# EAGLE design monster_dac (EAGLE 6.4)

## Sheet 1 of 3: DAC
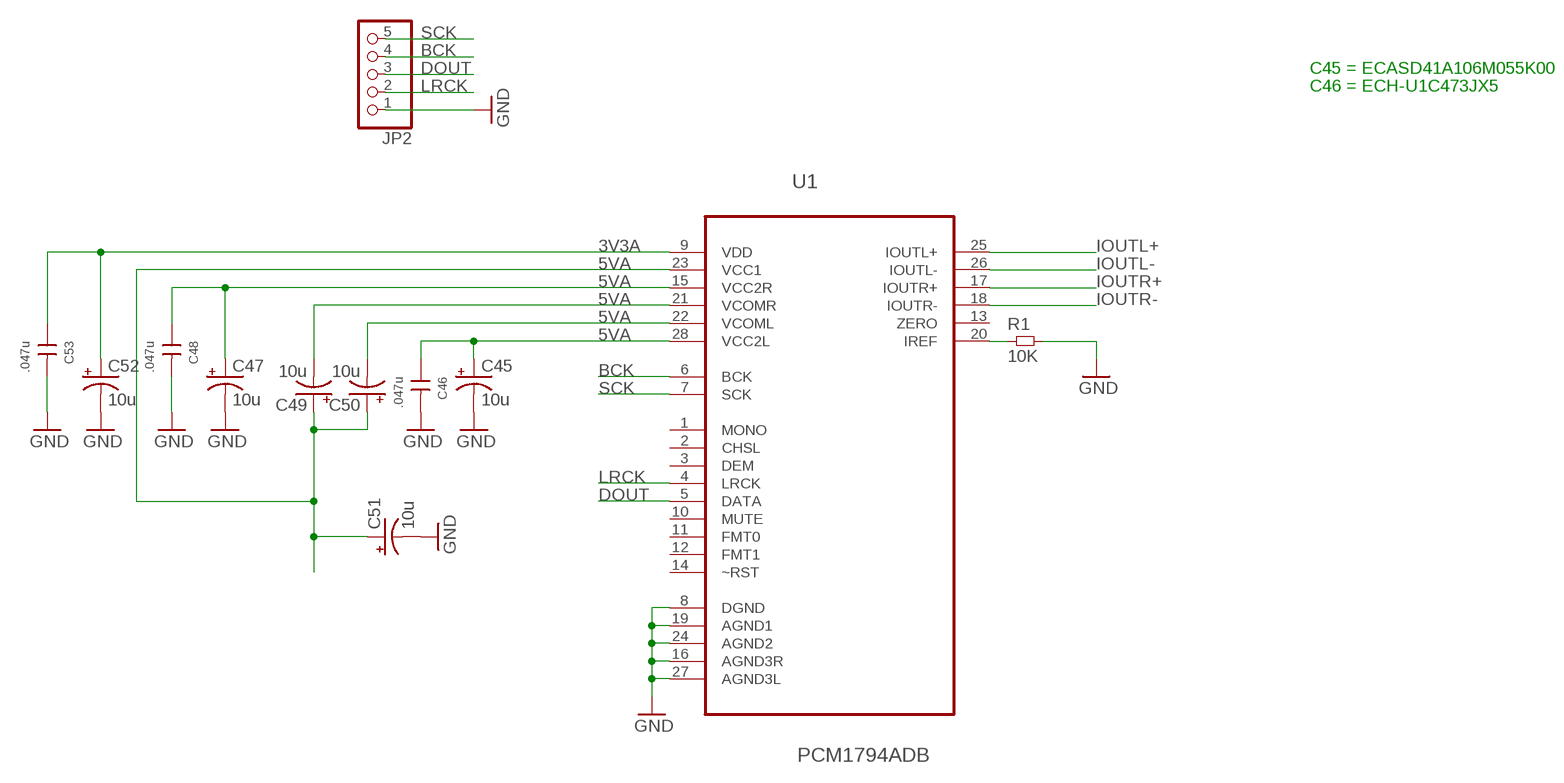
[diagram p0: schematic, sheet 1]

### Parts
C45  10u  CPOL-USE2-5  [E2-5]
C46  .047u  47NF63VMKS2  [2,5X6,5RM5,0]
C47  10u  CPOL-USE2-5  [E2-5]
C48  .047u  47NF63VMKS2  [2,5X6,5RM5,0]
C49  10u  CPOL-USE2-5  [E2-5]
C50  10u  CPOL-USE2-5  [E2-5]
C51  10u  CPOL-USE2-5  [E2-5]
C52  10u  CPOL-USE2-5  [E2-5]
C53  .047u  47NF63VMKS2  [2,5X6,5RM5,0]
JP2  PINHD-1X5  [1X05]
R1  10K  RES0603L3  [0603L3]
U1  PCM1794ADB  [SOP65P780X200-28N]

### Nets
3V3A: C52.+ C53.1 U1.9(VDD)
5VA: C45.+ C46.1 C47.+ C48.1 C49.+ C49.- C50.+ C50.- C51.+ U1.15(VCC2R) U1.21(VCOMR) U1.22(VCOML) U1.23(VCC1) U1.28(VCC2L)
BCK: JP2.4 U1.6(BCK)
DOUT: JP2.3 U1.5(DATA)
GND: C45.- C46.2 C47.- C48.2 C51.- C52.- C53.2 JP2.1 R1.P$2 U1.8(DGND) U1.16(AGND3R) U1.19(AGND1) U1.24(AGND2) U1.27(AGND3L) ; also sheet 2,3
IOUTL+: U1.25(IOUTL+) ; also sheet 2
IOUTL-: U1.26(IOUTL-) ; also sheet 2
IOUTR+: U1.17(IOUTR+) ; also sheet 2
IOUTR-: U1.18(IOUTR-) ; also sheet 2
LRCK: JP2.2 U1.4(LRCK)
N$2: R1.P$1 U1.20(IREF)
SCK: JP2.5 U1.7(SCK)
Unconnected: U1.1(MONO) U1.2(CHSL) U1.3(DEM) U1.10(MUTE) U1.11(FMT0) U1.12(FMT1) U1.13(ZERO) U1.14(~RST)

### Notes on the sheet
- C45 = ECASD41A106M055K00
- C46 = ECH-U1C473JX5

## Sheet 2 of 3: I/V Converter
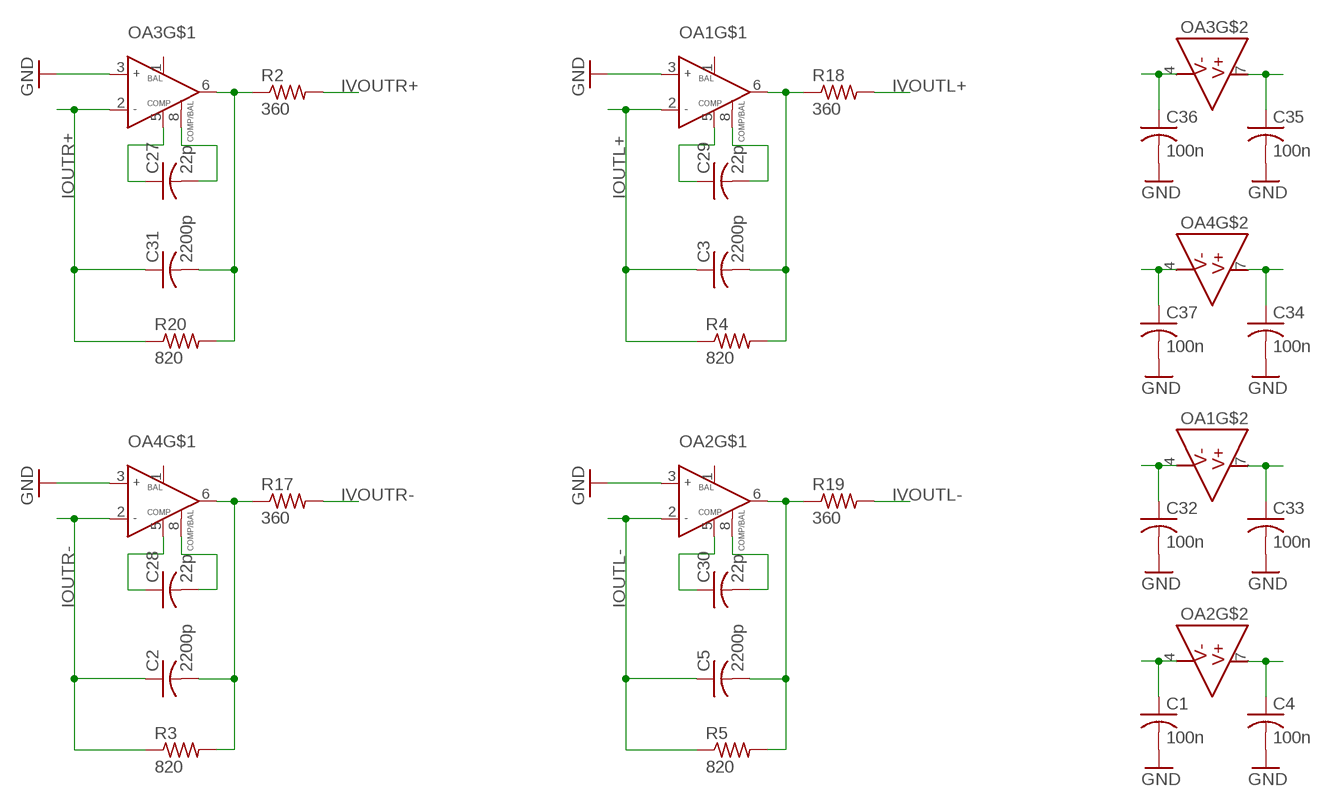
[diagram p1: schematic, sheet 2]

### Parts
C1  100n  C-USC0603  [C0603]
C2  2200p  C-USC0603  [C0603]
C3  2200p  C-USC0603  [C0603]
C4  100n  C-USC0603  [C0603]
C5  2200p  C-USC0603  [C0603]
C27  22p  C-USC0603  [C0603]
C28  22p  C-USC0603  [C0603]
C29  22p  C-USC0603  [C0603]
C30  22p  C-USC0603  [C0603]
C31  2200p  C-USC0603  [C0603]
C32  100n  C-USC0603  [C0603]
C33  100n  C-USC0603  [C0603]
C34  100n  C-USC0603  [C0603]
C35  100n  C-USC0603  [C0603]
C36  100n  C-USC0603  [C0603]
C37  100n  C-USC0603  [C0603]
OA1  NE5534ADSOIC8  [SOIC-8]
OA2  NE5534ADSOIC8  [SOIC-8]
OA3  NE5534ADSOIC8  [SOIC-8]
OA4  NE5534ADSOIC8  [SOIC-8]
R2  360  R-US_R0603  [R0603]
R3  820  R-US_R0603  [R0603]
R4  820  R-US_R0603  [R0603]
R5  820  R-US_R0603  [R0603]
R17  360  R-US_R0603  [R0603]
R18  360  R-US_R0603  [R0603]
R19  360  R-US_R0603  [R0603]
R20  820  R-US_R0603  [R0603]

### Nets
GND: C1.2 C4.2 C32.2 C33.2 C34.2 C35.2 C36.2 C37.2 OA1.3(IN+) OA2.3(IN+) OA3.3(IN+) OA4.3(IN+) ; also sheet 1,3
IOUTL+: C3.1 OA1.2(IN-) R4.1 ; also sheet 1
IOUTL-: C5.1 OA2.2(IN-) R5.1 ; also sheet 1
IOUTR+: C31.1 OA3.2(IN-) R20.1 ; also sheet 1
IOUTR-: C2.1 OA4.2(IN-) R3.1 ; also sheet 1
IVOUTL+: R18.2 ; also sheet 3
IVOUTL-: R19.2 ; also sheet 3
IVOUTR+: R2.2 ; also sheet 3
IVOUTR-: R17.2 ; also sheet 3
N$3: C4.1 OA2.7(V+)
N$5: C1.1 OA2.4(V-)
N$7: C33.1 OA1.7(V+)
N$10: C32.1 OA1.4(V-)
N$17: C27.1 OA3.5(COMP)
N$19: C27.2 OA3.8(COMP/BAL)
N$21: C28.1 OA4.5(COMP)
N$22: C28.2 OA4.8(COMP/BAL)
N$27: C29.1 OA1.5(COMP)
N$28: C29.2 OA1.8(COMP/BAL)
N$29: C30.1 OA2.5(COMP)
N$31: C30.2 OA2.8(COMP/BAL)
N$32: C31.2 OA3.6(OUT) R2.1 R20.2
N$35: C2.2 OA4.6(OUT) R3.2 R17.1
N$36: C3.2 OA1.6(OUT) R4.2 R18.1
N$37: C5.2 OA2.6(OUT) R5.2 R19.1
N$42: C37.1 OA4.4(V-)
N$43: C36.1 OA3.4(V-)
N$44: C35.1 OA3.7(V+)
N$45: C34.1 OA4.7(V+)
Unconnected: OA1.1(BAL) OA2.1(BAL) OA3.1(BAL) OA4.1(BAL)

## Sheet 3 of 3: Out Stage
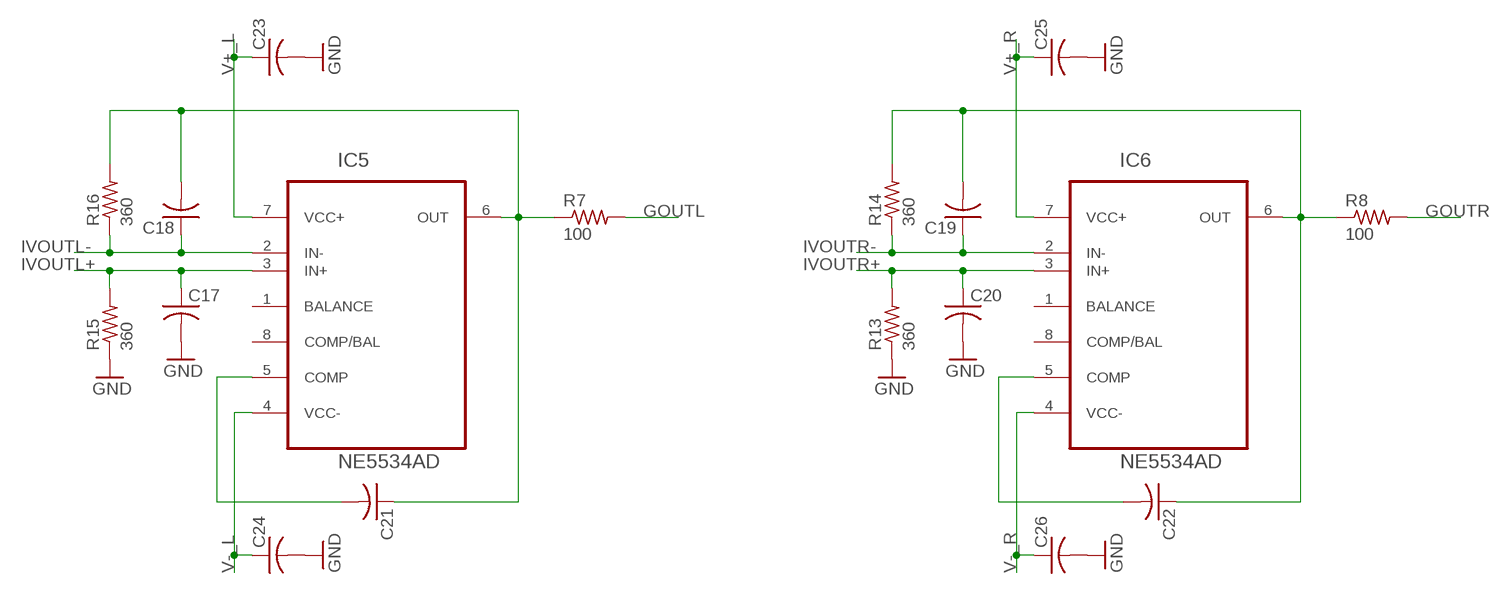
[diagram p2: schematic, sheet 3]

### Parts
C17  C-USC0603  [C0603]
C18  C-USC0603  [C0603]
C19  C-USC0603  [C0603]
C20  C-USC0603  [C0603]
C21  C-USC0603  [C0603]
C22  C-USC0603  [C0603]
C23  C-USC0603  [C0603]
C24  C-USC0603  [C0603]
C25  C-USC0603  [C0603]
C26  C-USC0603  [C0603]
IC5  NE5534AD  [SOIC127P600X175-8N]
IC6  NE5534AD  [SOIC127P600X175-8N]
R7  100  R-US_R0603  [R0603]
R8  100  R-US_R0603  [R0603]
R13  360  R-US_R0603  [R0603]
R14  360  R-US_R0603  [R0603]
R15  360  R-US_R0603  [R0603]
R16  360  R-US_R0603  [R0603]

### Nets
GND: C17.2 C20.2 C23.2 C24.2 C25.2 C26.2 R13.1 R15.1 ; also sheet 1,2
GOUTL: R7.2
GOUTR: R8.2
IVOUTL+: C17.1 IC5.3(IN+) R15.2 ; also sheet 2
IVOUTL-: C18.1 IC5.2(IN-) R16.1 ; also sheet 2
IVOUTR+: C20.1 IC6.3(IN+) R13.2 ; also sheet 2
IVOUTR-: C19.1 IC6.2(IN-) R14.1 ; also sheet 2
N$1: C18.2 C21.1 IC5.6(OUT) R7.1 R16.2
N$13: C19.2 C22.1 IC6.6(OUT) R8.1 R14.2
N$20: C21.2 IC5.5(COMP)
N$25: C22.2 IC6.5(COMP)
V+_L: C23.1 IC5.7(VCC+)
V+_R: C25.1 IC6.7(VCC+)
V-_L: C24.1 IC5.4(VCC-)
V-_R: C26.1 IC6.4(VCC-)
Unconnected: IC5.1(BALANCE) IC5.8(COMP/BAL) IC6.1(BALANCE) IC6.8(COMP/BAL)

## Library data of the parts
C1-C5 C17-C37 = rcl:C-US: CAPACITOR, American symbol
C45 C47 C49-C52 = rcl:CPOL-US: POLARIZED CAPACITOR, American symbol
C46 C48 C53 = wima_c:47NF63V
IC5 IC6 = Texas Instruments_By_element14_Batch_1:NE5534AD: LOW-NOISE OPERATIONAL AMPLIFIERS; MPN: NE5534AD; OC_FARNELL: 9589864; OC_NEWARK: 08F2508; PACKAGE: SOIC-8; SUPPLIER: Texas Instruments
JP2 = pinhead:PINHD-1X5: PIN HEADER
OA1-OA4 = common:NE5534: Low-noise, high-SP audio Op Amp.; BIAS_CURRENT: 500nA; CMRR: 100dB; GAIN_BANDWIDTH_PRODUCT: 10MHz; IN-VOL_NOISE_DENSITY: 3.5nV; OFFSET_VOL: 500uV; OUTPUT_CURRENT: 38mA; SLEW_RATE: 13V/uS; SUPPLY_CURRENT: 4mA; SUPPLY_VOL_MAX: 30V; SUPPLY_VOL_MIN: 10V
R1 = common:RES
R2-R5 R7 R8 R13-R20 = rcl:R-US_: RESISTOR, American symbol
U1 = Texas Instruments_By_element14_Batch_1:PCM1794ADB: 24-Bit 192khz Sampling advanced segment Audio stereo digital-to-analog converter; MPN: PCM1794ADB; OC_FARNELL: 1755014; OC_NEWARK: 54K0199; PACKAGE: SSOP-28; SUPPLIER: Texas Instruments

## Board
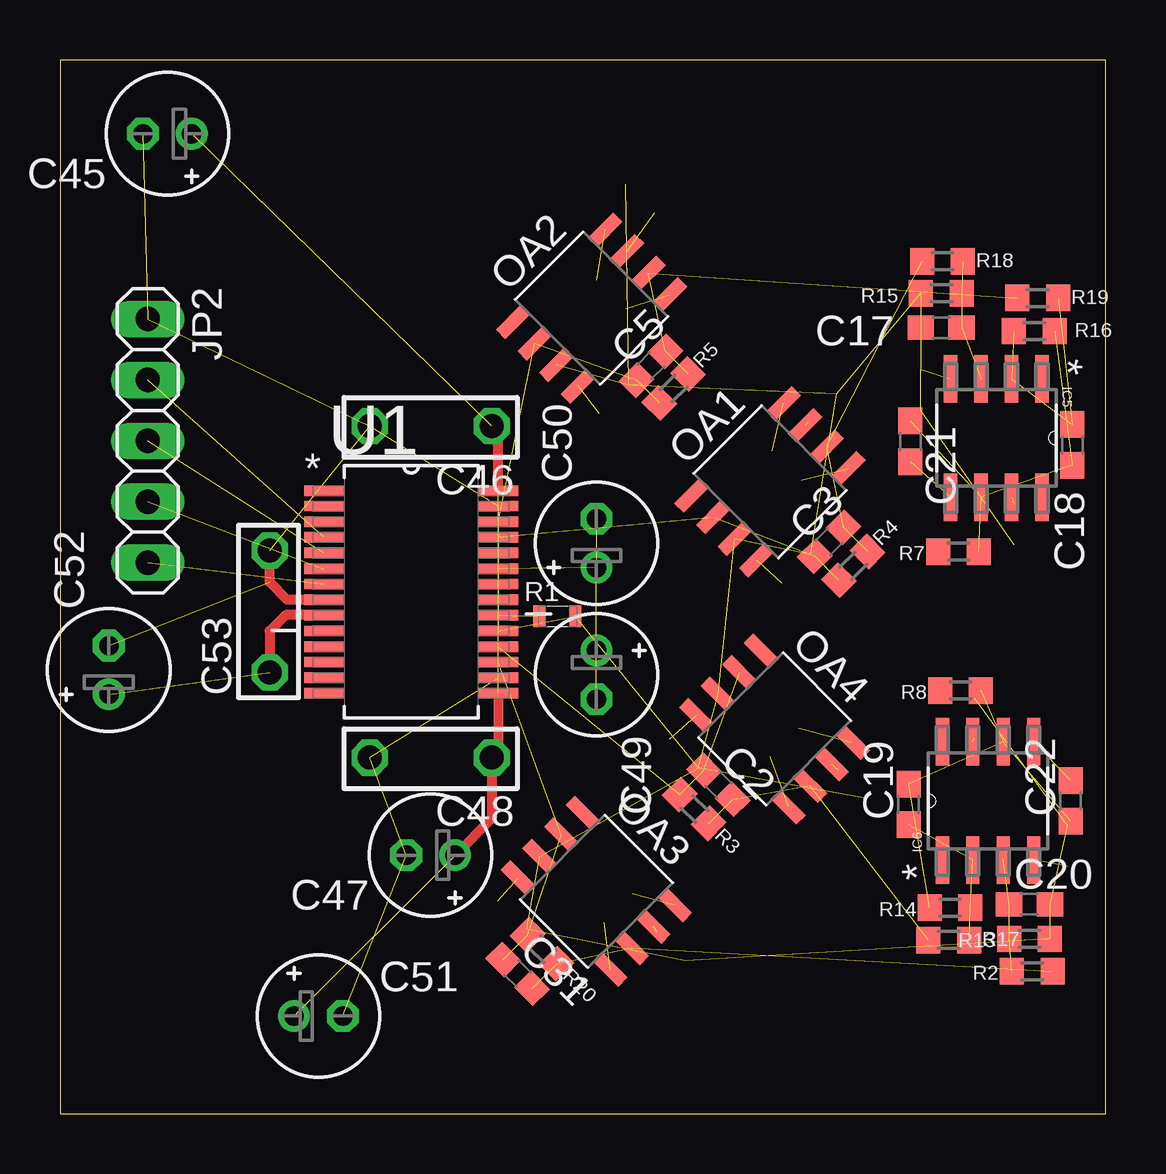
[diagram p3: board, top side]
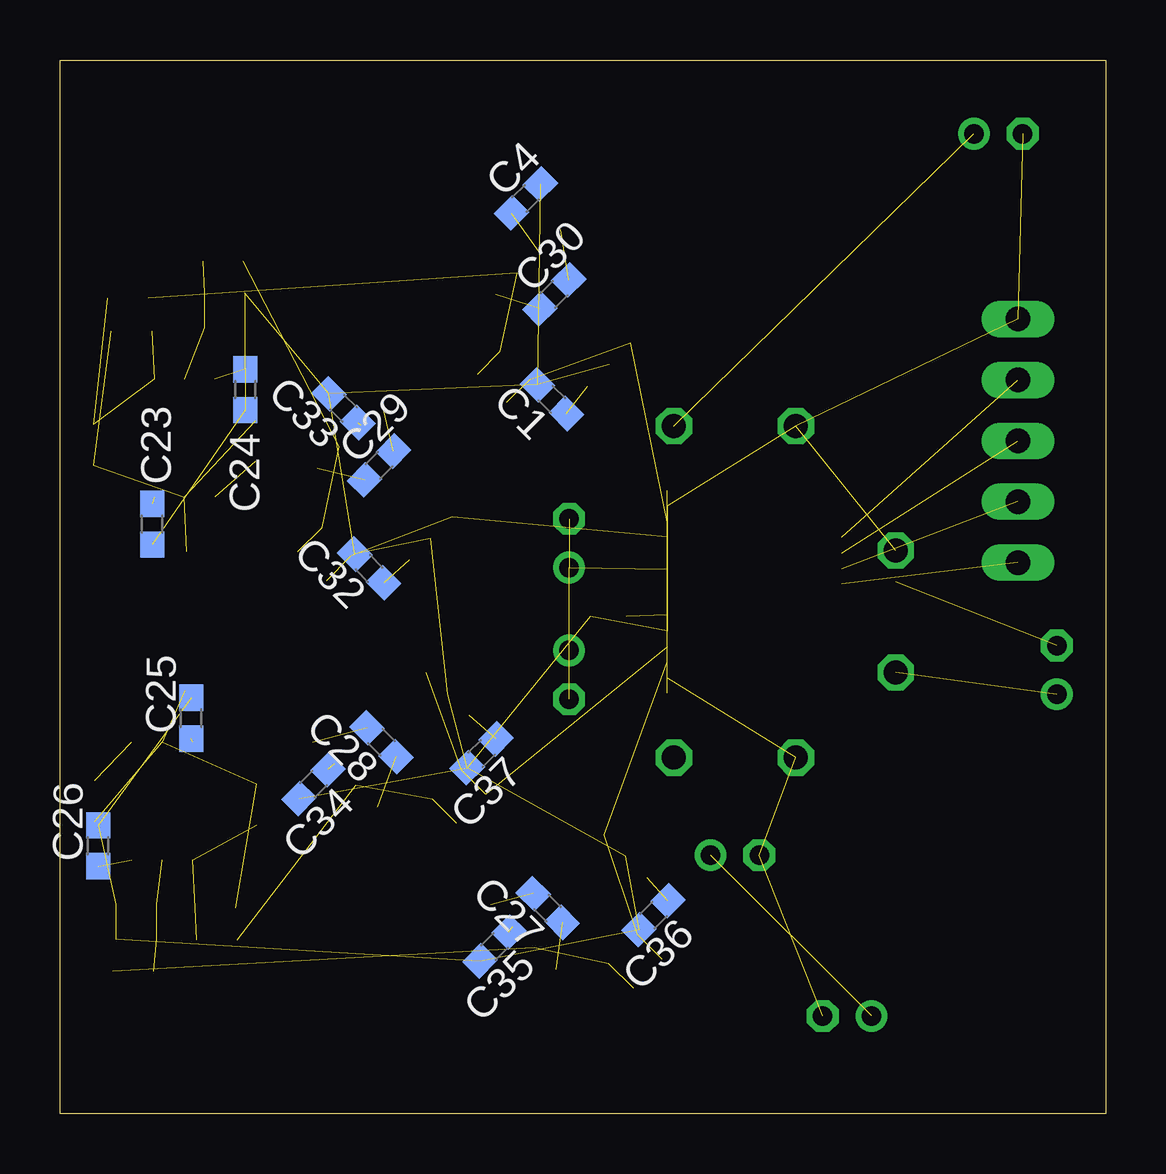
[diagram p4: board, bottom side, seen from below]

Size 43.57 x 43.92 mm. Coordinates in mm from the lower left corner, seen from the top.
Outline: 0,0 43.57,0 43.57,43.92 0,43.92 0,0
Copper layers (1*2*3*16): Top 0.035mm / dielectric 1.5mm / Route2 0.035mm / dielectric 0.15mm / Route3 0.035mm / dielectric 0.2mm / Bottom 0.035mm
Design rules "default *": minimum track width 10mil, minimum drill 24mil, track to track 8mil, track to pad 8mil, pad to pad 8mil, via to via 8mil, smd to smd 8mil, copper to edge 13mil, drill to drill 8mil, minimum pad ring 10mil, minimum via ring 8mil, stop-mask expansion 4mil, vias tented up to drill 0mil, thermal gap 10mil

### Footprints (pad centres in the part's own frame; a part is rotated, then mirrored left to right if it is on the bottom)
C0603 = smd 1.1 x 1: 1 -0.85,0; 2 0.85,0
E2-5 = drill 0.813 pad 1.27: + -1.016,0 | drill 0.813 pad 1.27 octagon: - 1.016,0
2,5X6,5RM5,0 = drill 1 pad 1.5 octagon: 1 -2.54,0; 2 2.54,0
SOIC127P600X175-8N = smd 1.981 x 0.559: 1 -2.464,1.905; 2 -2.464,0.635; 3 -2.464,-0.635; 4 -2.464,-1.905; 5 2.464,-1.905; 6 2.464,-0.635; 7 2.464,0.635; 8 2.464,1.905
1X05 = drill 1.016 long: 1 -5.08,0; 2 -2.54,0; 3 0,0; 4 2.54,0; 5 5.08,0
SOIC-8 = smd 0.55 x 1.5: 1 -1.905,-2.7; 2 -0.635,-2.7; 3 0.635,-2.7; 4 1.905,-2.7; 5 1.905,2.7; 6 0.635,2.7; 7 -0.635,2.7; 8 -1.905,2.7
0603L3 = smd 0.5 x 0.9: P$1 -0.75,0; P$2 0.75,0
R0603 = smd 1 x 1.1: 1 -0.85,0; 2 0.85,0
SOP65P780X200-28N = smd 1.651 x 0.432: 1 -3.632,4.216; 2 -3.632,3.581; 3 -3.632,2.921; 4 -3.632,2.286; 5 -3.632,1.626; 6 -3.632,0.965; 7 -3.632,0.33; 8 -3.632,-0.33; 9 -3.632,-0.965; 10 -3.632,-1.626; 11 -3.632,-2.286; 12 -3.632,-2.921; 13 -3.632,-3.581; 14 -3.632,-4.216; 15 3.632,-4.216; 16 3.632,-3.581; 17 3.632,-2.921; 18 3.632,-2.286; 19 3.632,-1.626; 20 3.632,-0.965; 21 3.632,-0.33; 22 3.632,0.33; 23 3.632,0.965; 24 3.632,1.626; 25 3.632,2.286; 26 3.632,2.921; 27 3.632,3.581; 28 3.632,4.216

### Placement (x,y rotation side)
C1  23.07,29.78 135 bottom
C2  27.43,13.7 315 top
C3  32.05,23.83 45 top
C4  24.16,38.14 45 bottom
C5  24.62,31.17 45 top
C17  36.72,32.76 180 top
C18  42.18,27.87 270 top
C19  35.36,12.89 90 top
C20  40.39,8.72 0 top
C21  35.42,28.02 270 top
C22  42.12,13.03 90 top
C23  39.73,24.57 270 bottom
C24  35.85,30.17 270 bottom
C25  38.09,16.48 90 bottom
C26  41.97,11.16 90 bottom
C27  23.25,8.57 135 bottom
C28  30.17,15.48 135 bottom
C29  30.28,27.01 45 bottom
C30  22.97,34.15 45 bottom
C31  19.07,5.82 315 top
C32  30.68,22.72 135 bottom
C33  31.76,29.4 135 bottom
C34  33,13.73 225 bottom
C35  25.46,6.97 225 bottom
C36  18.84,8.27 225 bottom
C37  26,15.01 225 bottom
C45  4.47,40.84 180 top
C46  15.44,28.65 180 top
C47  15.44,10.77 180 top
C48  15.44,14.83 180 top
C49  22.35,18.29 270 top
C50  22.35,23.77 90 top
C51  10.77,4.06 0 top
C52  2.03,18.49 90 top
C53  8.74,20.93 90 top
IC5  39.01,28.16 270 top
IC6  38.67,13.03 90 top
JP2  3.66,28.04 270 top
OA1  29.58,26.33 315 top
OA2  22.15,33.58 315 top
OA3  22.35,9.26 225 top
OA4  29.78,16.03 225 top
R1  20.73,20.73 0 top
R2  40.51,5.93 180 top
R3  26.43,12.69 315 top
R4  33.05,22.83 45 top
R5  25.57,30.23 45 top
R7  37.43,23.42 180 top
R8  37.52,17.63 180 top
R13  40.39,7.28 180 top
R14  37.09,8.58 180 top
R15  36.72,34.2 0 top
R16  40.59,32.61 0 top
R17  37.03,7.23 0 top
R18  36.77,35.52 0 top
R19  40.74,33.99 0 top
R20  20.09,6.85 315 top
U1  14.63,21.74 0 top

### Tracks (layer width: path | path; a pad name or v marks a point on that pad's centre or on a via)
3V3A  (1 unrouted)
  Top 0.406: U1.9 9.4,20.78 8.74,20.12 C53.1
5VA  (10 unrouted)
  Top 0.406: U1.28 18.26,28.37 C46.1 | U1.15 18.26,15.11 C48.1 17.98,12.29 C47.+
BCK  (1 unrouted)
DOUT  (1 unrouted)
GND  (32 unrouted)
  Top 0.406: U1.8 9.47,21.41 8.74,22.15 C53.2
IOUTL+  (3 unrouted)
IOUTL-  (3 unrouted)
IOUTR+  (3 unrouted)
IOUTR-  (3 unrouted)
IVOUTL+  (3 unrouted)
IVOUTL-  (3 unrouted)
IVOUTR+  (3 unrouted)
IVOUTR-  (3 unrouted)
LRCK  (1 unrouted)
N$1  (4 unrouted)
N$2  (1 unrouted)
N$3  (1 unrouted)
N$5  (1 unrouted)
N$7  (1 unrouted)
N$10  (1 unrouted)
N$13  (4 unrouted)
N$17  (1 unrouted)
N$19  (1 unrouted)
N$20  (1 unrouted)
N$21  (1 unrouted)
N$22  (1 unrouted)
N$25  (1 unrouted)
N$27  (1 unrouted)
N$28  (1 unrouted)
N$29  (1 unrouted)
N$31  (1 unrouted)
N$32  (3 unrouted)
N$35  (3 unrouted)
N$36  (3 unrouted)
N$37  (3 unrouted)
N$42  (1 unrouted)
N$43  (1 unrouted)
N$44  (1 unrouted)
N$45  (1 unrouted)
SCK  (1 unrouted)
V+_L  (1 unrouted)
V+_R  (1 unrouted)
V-_L  (1 unrouted)
V-_R  (1 unrouted)